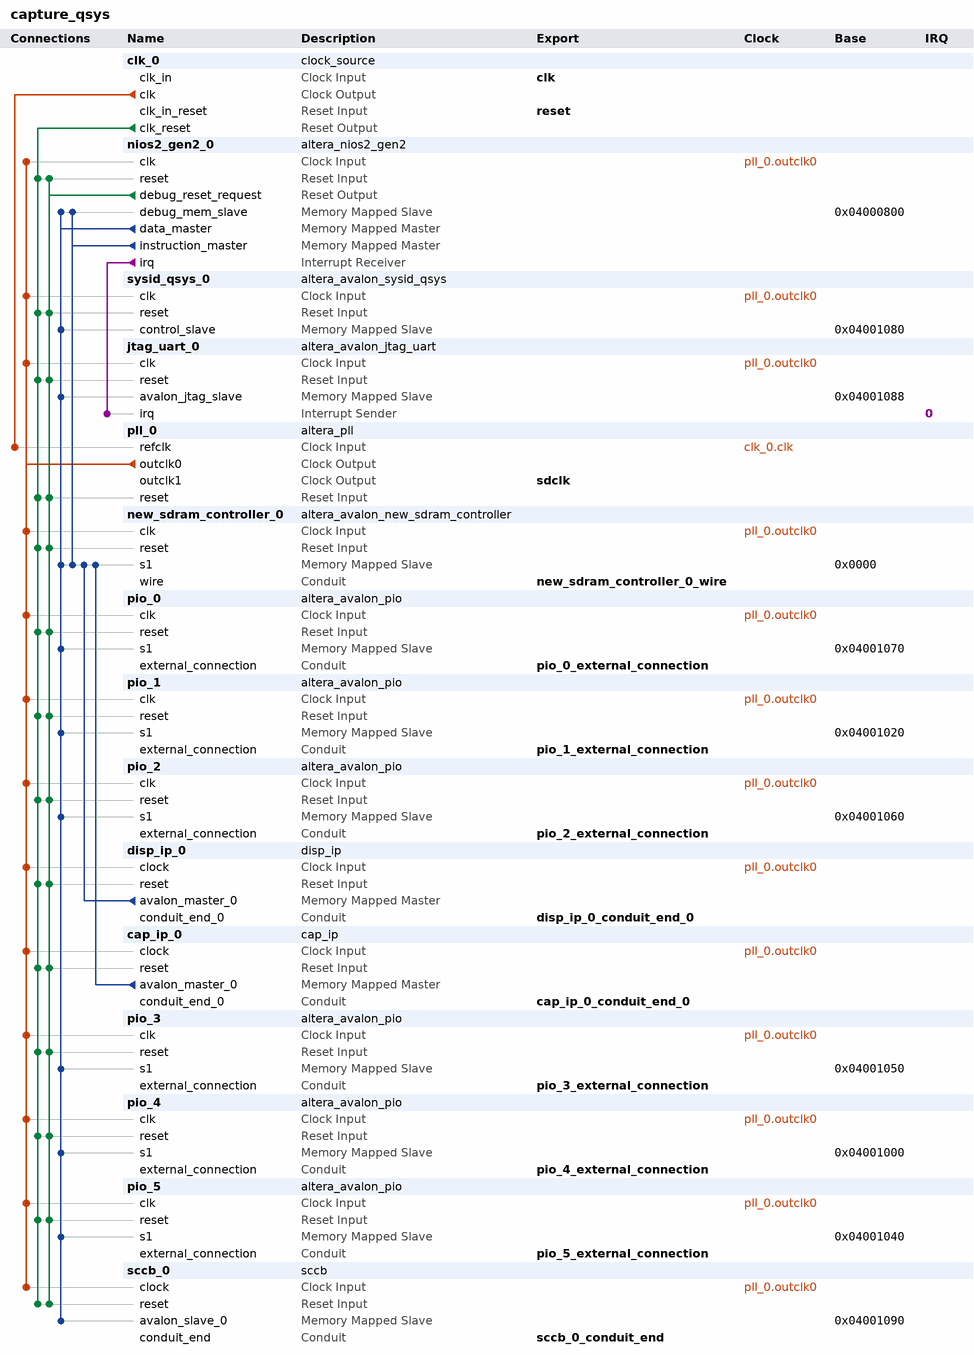
[diagram p0: system contents]
# Platform Designer (Qsys) system capture_qsys, Cyclone V 5CEBA4F23C7
# Parameters at their usual value, and those the tool derives, are not listed.
package require -exact qsys 17.0
create_system capture_qsys
set_project_property DEVICE_FAMILY {Cyclone V}
set_project_property DEVICE 5CEBA4F23C7

add_instance clk_0 clock_source 17.0
set_instance_parameter_value clk_0 clockFrequency 50000000

add_instance nios2_gen2_0 altera_nios2_gen2 17.0
set_instance_parameter_value nios2_gen2_0 dcache_size 2048
set_instance_parameter_value nios2_gen2_0 exceptionSlave new_sdram_controller_0.s1
set_instance_parameter_value nios2_gen2_0 icache_size 4096
set_instance_parameter_value nios2_gen2_0 impl Fast
set_instance_parameter_value nios2_gen2_0 resetSlave new_sdram_controller_0.s1

add_instance sysid_qsys_0 altera_avalon_sysid_qsys 17.0
set_instance_parameter_value sysid_qsys_0 id 0

add_instance jtag_uart_0 altera_avalon_jtag_uart 17.0
set_instance_parameter_value jtag_uart_0 simInteractiveOptions NO_INTERACTIVE_WINDOWS

add_instance pll_0 altera_pll 17.0
set_instance_parameter_value pll_0 gui_device_speed_grade 1
set_instance_parameter_value pll_0 gui_number_of_clocks 2
set_instance_parameter_value pll_0 gui_operation_mode direct
set_instance_parameter_value pll_0 gui_output_clock_frequency0 100.0
set_instance_parameter_value pll_0 gui_output_clock_frequency1 100.0
set_instance_parameter_value pll_0 gui_phase_shift1 -3000
set_instance_parameter_value pll_0 gui_pll_mode {Integer-N PLL}
set_instance_parameter_value pll_0 gui_reference_clock_frequency 50.0
set_instance_parameter_value pll_0 gui_use_locked false

add_instance new_sdram_controller_0 altera_avalon_new_sdram_controller 17.0
set_instance_parameter_value new_sdram_controller_0 TAC 5.4
set_instance_parameter_value new_sdram_controller_0 TRCD 15.0
set_instance_parameter_value new_sdram_controller_0 TRP 15.0
set_instance_parameter_value new_sdram_controller_0 casLatency 3
set_instance_parameter_value new_sdram_controller_0 columnWidth 10
set_instance_parameter_value new_sdram_controller_0 dataWidth 16
set_instance_parameter_value new_sdram_controller_0 generateSimulationModel false
set_instance_parameter_value new_sdram_controller_0 model single_Micron_MT48LC4M32B2_7_chip
set_instance_parameter_value new_sdram_controller_0 numberOfBanks 4
set_instance_parameter_value new_sdram_controller_0 numberOfChipSelects 1
set_instance_parameter_value new_sdram_controller_0 powerUpDelay 100.0
set_instance_parameter_value new_sdram_controller_0 refreshPeriod 7.8125
set_instance_parameter_value new_sdram_controller_0 rowWidth 13

add_instance pio_0 altera_avalon_pio 17.0
set_instance_parameter_value pio_0 direction Output
set_instance_parameter_value pio_0 width 26

add_instance pio_1 altera_avalon_pio 17.0
set_instance_parameter_value pio_1 bitModifyingOutReg true
set_instance_parameter_value pio_1 direction Output
set_instance_parameter_value pio_1 width 2

add_instance pio_2 altera_avalon_pio 17.0
set_instance_parameter_value pio_2 direction Input
set_instance_parameter_value pio_2 width 1

add_instance disp_ip_0 disp_ip 1.0

add_instance cap_ip_0 cap_ip 1.0

add_instance pio_3 altera_avalon_pio 17.0
set_instance_parameter_value pio_3 direction Output
set_instance_parameter_value pio_3 width 26

add_instance pio_4 altera_avalon_pio 17.0
set_instance_parameter_value pio_4 bitModifyingOutReg true
set_instance_parameter_value pio_4 direction Output
set_instance_parameter_value pio_4 width 2

add_instance pio_5 altera_avalon_pio 17.0
set_instance_parameter_value pio_5 direction Input
set_instance_parameter_value pio_5 width 1

add_instance sccb_0 sccb 1.0

# connections
add_connection clk_0.clk pll_0.refclk clock
add_connection pll_0.outclk0 cap_ip_0.clock clock
add_connection pll_0.outclk0 disp_ip_0.clock clock
add_connection pll_0.outclk0 jtag_uart_0.clk clock
add_connection pll_0.outclk0 new_sdram_controller_0.clk clock
add_connection pll_0.outclk0 nios2_gen2_0.clk clock
add_connection pll_0.outclk0 pio_0.clk clock
add_connection pll_0.outclk0 pio_1.clk clock
add_connection pll_0.outclk0 pio_2.clk clock
add_connection pll_0.outclk0 pio_3.clk clock
add_connection pll_0.outclk0 pio_4.clk clock
add_connection pll_0.outclk0 pio_5.clk clock
add_connection pll_0.outclk0 sccb_0.clock clock
add_connection pll_0.outclk0 sysid_qsys_0.clk clock
add_connection clk_0.clk_reset cap_ip_0.reset reset
add_connection clk_0.clk_reset disp_ip_0.reset reset
add_connection clk_0.clk_reset jtag_uart_0.reset reset
add_connection clk_0.clk_reset new_sdram_controller_0.reset reset
add_connection clk_0.clk_reset nios2_gen2_0.reset reset
add_connection clk_0.clk_reset pio_0.reset reset
add_connection clk_0.clk_reset pio_1.reset reset
add_connection clk_0.clk_reset pio_2.reset reset
add_connection clk_0.clk_reset pio_3.reset reset
add_connection clk_0.clk_reset pio_4.reset reset
add_connection clk_0.clk_reset pio_5.reset reset
add_connection clk_0.clk_reset pll_0.reset reset
add_connection clk_0.clk_reset sccb_0.reset reset
add_connection clk_0.clk_reset sysid_qsys_0.reset reset
add_connection nios2_gen2_0.debug_reset_request cap_ip_0.reset reset
add_connection nios2_gen2_0.debug_reset_request disp_ip_0.reset reset
add_connection nios2_gen2_0.debug_reset_request jtag_uart_0.reset reset
add_connection nios2_gen2_0.debug_reset_request new_sdram_controller_0.reset reset
add_connection nios2_gen2_0.debug_reset_request nios2_gen2_0.reset reset
add_connection nios2_gen2_0.debug_reset_request pio_0.reset reset
add_connection nios2_gen2_0.debug_reset_request pio_1.reset reset
add_connection nios2_gen2_0.debug_reset_request pio_2.reset reset
add_connection nios2_gen2_0.debug_reset_request pio_3.reset reset
add_connection nios2_gen2_0.debug_reset_request pio_4.reset reset
add_connection nios2_gen2_0.debug_reset_request pio_5.reset reset
add_connection nios2_gen2_0.debug_reset_request pll_0.reset reset
add_connection nios2_gen2_0.debug_reset_request sccb_0.reset reset
add_connection nios2_gen2_0.debug_reset_request sysid_qsys_0.reset reset
add_connection cap_ip_0.avalon_master_0 new_sdram_controller_0.s1 avalon
set_connection_parameter_value cap_ip_0.avalon_master_0/new_sdram_controller_0.s1 baseAddress 0x0000
add_connection disp_ip_0.avalon_master_0 new_sdram_controller_0.s1 avalon
set_connection_parameter_value disp_ip_0.avalon_master_0/new_sdram_controller_0.s1 baseAddress 0x0000
add_connection nios2_gen2_0.data_master jtag_uart_0.avalon_jtag_slave avalon
set_connection_parameter_value nios2_gen2_0.data_master/jtag_uart_0.avalon_jtag_slave baseAddress 0x04001088
add_connection nios2_gen2_0.data_master new_sdram_controller_0.s1 avalon
set_connection_parameter_value nios2_gen2_0.data_master/new_sdram_controller_0.s1 baseAddress 0x0000
add_connection nios2_gen2_0.data_master nios2_gen2_0.debug_mem_slave avalon
set_connection_parameter_value nios2_gen2_0.data_master/nios2_gen2_0.debug_mem_slave baseAddress 0x04000800
add_connection nios2_gen2_0.data_master pio_0.s1 avalon
set_connection_parameter_value nios2_gen2_0.data_master/pio_0.s1 baseAddress 0x04001070
add_connection nios2_gen2_0.data_master pio_1.s1 avalon
set_connection_parameter_value nios2_gen2_0.data_master/pio_1.s1 baseAddress 0x04001020
add_connection nios2_gen2_0.data_master pio_2.s1 avalon
set_connection_parameter_value nios2_gen2_0.data_master/pio_2.s1 baseAddress 0x04001060
add_connection nios2_gen2_0.data_master pio_3.s1 avalon
set_connection_parameter_value nios2_gen2_0.data_master/pio_3.s1 baseAddress 0x04001050
add_connection nios2_gen2_0.data_master pio_4.s1 avalon
set_connection_parameter_value nios2_gen2_0.data_master/pio_4.s1 baseAddress 0x04001000
add_connection nios2_gen2_0.data_master pio_5.s1 avalon
set_connection_parameter_value nios2_gen2_0.data_master/pio_5.s1 baseAddress 0x04001040
add_connection nios2_gen2_0.data_master sccb_0.avalon_slave_0 avalon
set_connection_parameter_value nios2_gen2_0.data_master/sccb_0.avalon_slave_0 baseAddress 0x04001090
add_connection nios2_gen2_0.data_master sysid_qsys_0.control_slave avalon
set_connection_parameter_value nios2_gen2_0.data_master/sysid_qsys_0.control_slave baseAddress 0x04001080
add_connection nios2_gen2_0.instruction_master new_sdram_controller_0.s1 avalon
set_connection_parameter_value nios2_gen2_0.instruction_master/new_sdram_controller_0.s1 baseAddress 0x0000
add_connection nios2_gen2_0.instruction_master nios2_gen2_0.debug_mem_slave avalon
set_connection_parameter_value nios2_gen2_0.instruction_master/nios2_gen2_0.debug_mem_slave baseAddress 0x04000800
add_connection nios2_gen2_0.irq jtag_uart_0.irq interrupt
set_connection_parameter_value nios2_gen2_0.irq/jtag_uart_0.irq irqNumber 0

# exported interfaces
add_interface cap_ip_0_conduit_end_0 conduit end
set_interface_property cap_ip_0_conduit_end_0 EXPORT_OF cap_ip_0.conduit_end_0
add_interface clk clock sink
set_interface_property clk EXPORT_OF clk_0.clk_in
add_interface disp_ip_0_conduit_end_0 conduit end
set_interface_property disp_ip_0_conduit_end_0 EXPORT_OF disp_ip_0.conduit_end_0
add_interface new_sdram_controller_0_wire conduit end
set_interface_property new_sdram_controller_0_wire EXPORT_OF new_sdram_controller_0.wire
add_interface pio_0_external_connection conduit end
set_interface_property pio_0_external_connection EXPORT_OF pio_0.external_connection
add_interface pio_1_external_connection conduit end
set_interface_property pio_1_external_connection EXPORT_OF pio_1.external_connection
add_interface pio_2_external_connection conduit end
set_interface_property pio_2_external_connection EXPORT_OF pio_2.external_connection
add_interface pio_3_external_connection conduit end
set_interface_property pio_3_external_connection EXPORT_OF pio_3.external_connection
add_interface pio_4_external_connection conduit end
set_interface_property pio_4_external_connection EXPORT_OF pio_4.external_connection
add_interface pio_5_external_connection conduit end
set_interface_property pio_5_external_connection EXPORT_OF pio_5.external_connection
add_interface reset reset sink
set_interface_property reset EXPORT_OF clk_0.clk_in_reset
add_interface sccb_0_conduit_end conduit end
set_interface_property sccb_0_conduit_end EXPORT_OF sccb_0.conduit_end
add_interface sdclk clock source
set_interface_property sdclk EXPORT_OF pll_0.outclk1

set_interconnect_requirement {$system} qsys_mm.clockCrossingAdapter HANDSHAKE
set_interconnect_requirement {$system} qsys_mm.enableEccProtection FALSE
set_interconnect_requirement {$system} qsys_mm.insertDefaultSlave FALSE
set_interconnect_requirement {$system} qsys_mm.maxAdditionalLatency 1

save_system capture_qsys.qsys
